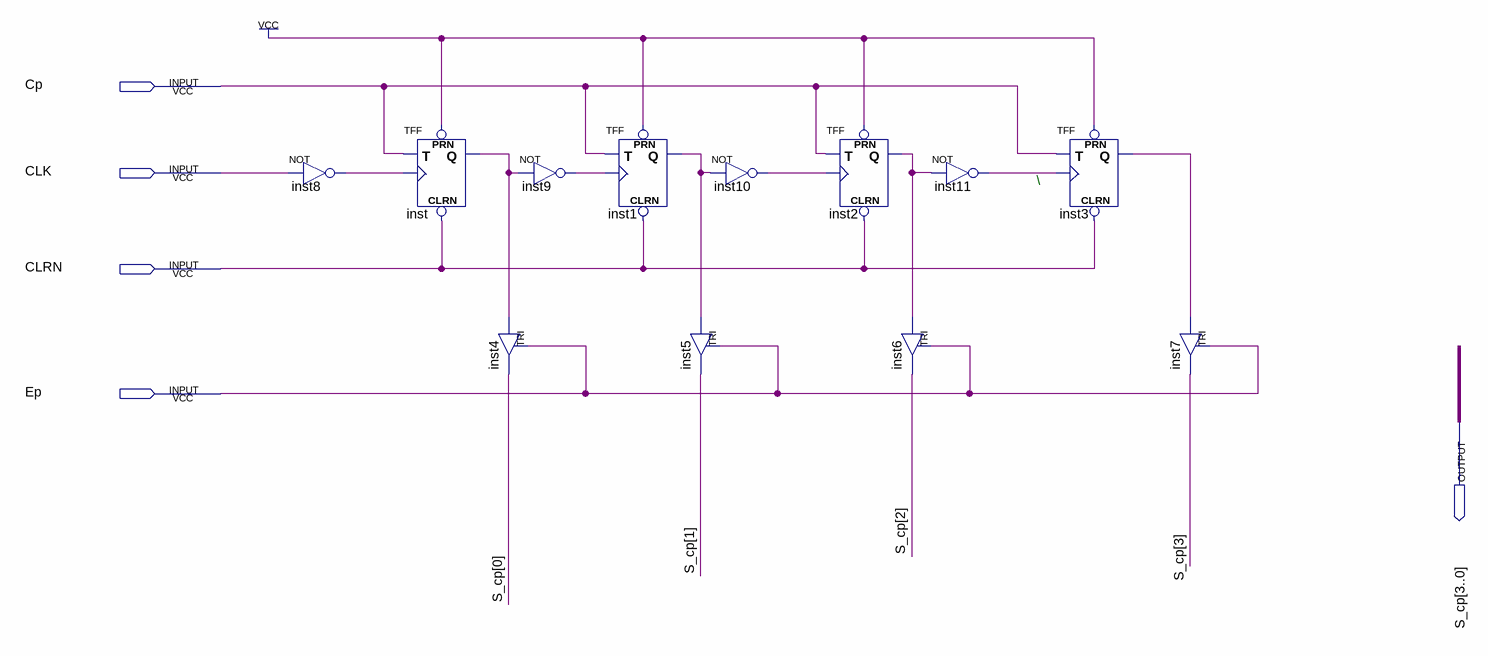
[diagram p0: schematic sheet]
// Quartus schematic Contador_Programa.bdf as structural Verilog: 12 symbols, 5 pins
module Contador_Programa (
  input  Cp,
  input  CLK,
  input  CLRN,
  input  Ep,
  output [3:0] S_cp
);

  wire inst1_q, inst2_q, inst3_q, inst8_out, inst9_out, inst10_out, inst11_out, inst_q;

  not inst8 (inst8_out, CLK);
  TFF inst (.PRN(1'b1), .CLRN(CLRN), .T(Cp), .CLK(inst8_out), .Q(inst_q));
  not inst9 (inst9_out, inst_q);
  TRI inst4 (.IN(inst_q), .OE(Ep), .OUT(S_cp[0]));
  TFF inst1 (.PRN(1'b1), .CLRN(CLRN), .T(Cp), .CLK(inst9_out), .Q(inst1_q));
  not inst10 (inst10_out, inst1_q);
  TRI inst5 (.IN(inst1_q), .OE(Ep), .OUT(S_cp[1]));
  TFF inst2 (.PRN(1'b1), .CLRN(CLRN), .T(Cp), .CLK(inst10_out), .Q(inst2_q));
  not inst11 (inst11_out, inst2_q);
  TRI inst6 (.IN(inst2_q), .OE(Ep), .OUT(S_cp[2]));
  TFF inst3 (.PRN(1'b1), .CLRN(CLRN), .T(Cp), .CLK(inst11_out), .Q(inst3_q));
  TRI inst7 (.IN(inst3_q), .OE(Ep), .OUT(S_cp[3]));

  // Notes on the sheet:
  //   \
endmodule
